# EasyEDA Pro project SoupPico.epro

# Schematic Schematic1
Board Name: Board1; Create Date: 2026-05-25; Page Name: P1; Project Name: Soup Pi; Schematic Name: Schematic1; Update Date: 2026-05-25; Company: EasyEDA.com; Page Size: A4; Version: V1.0
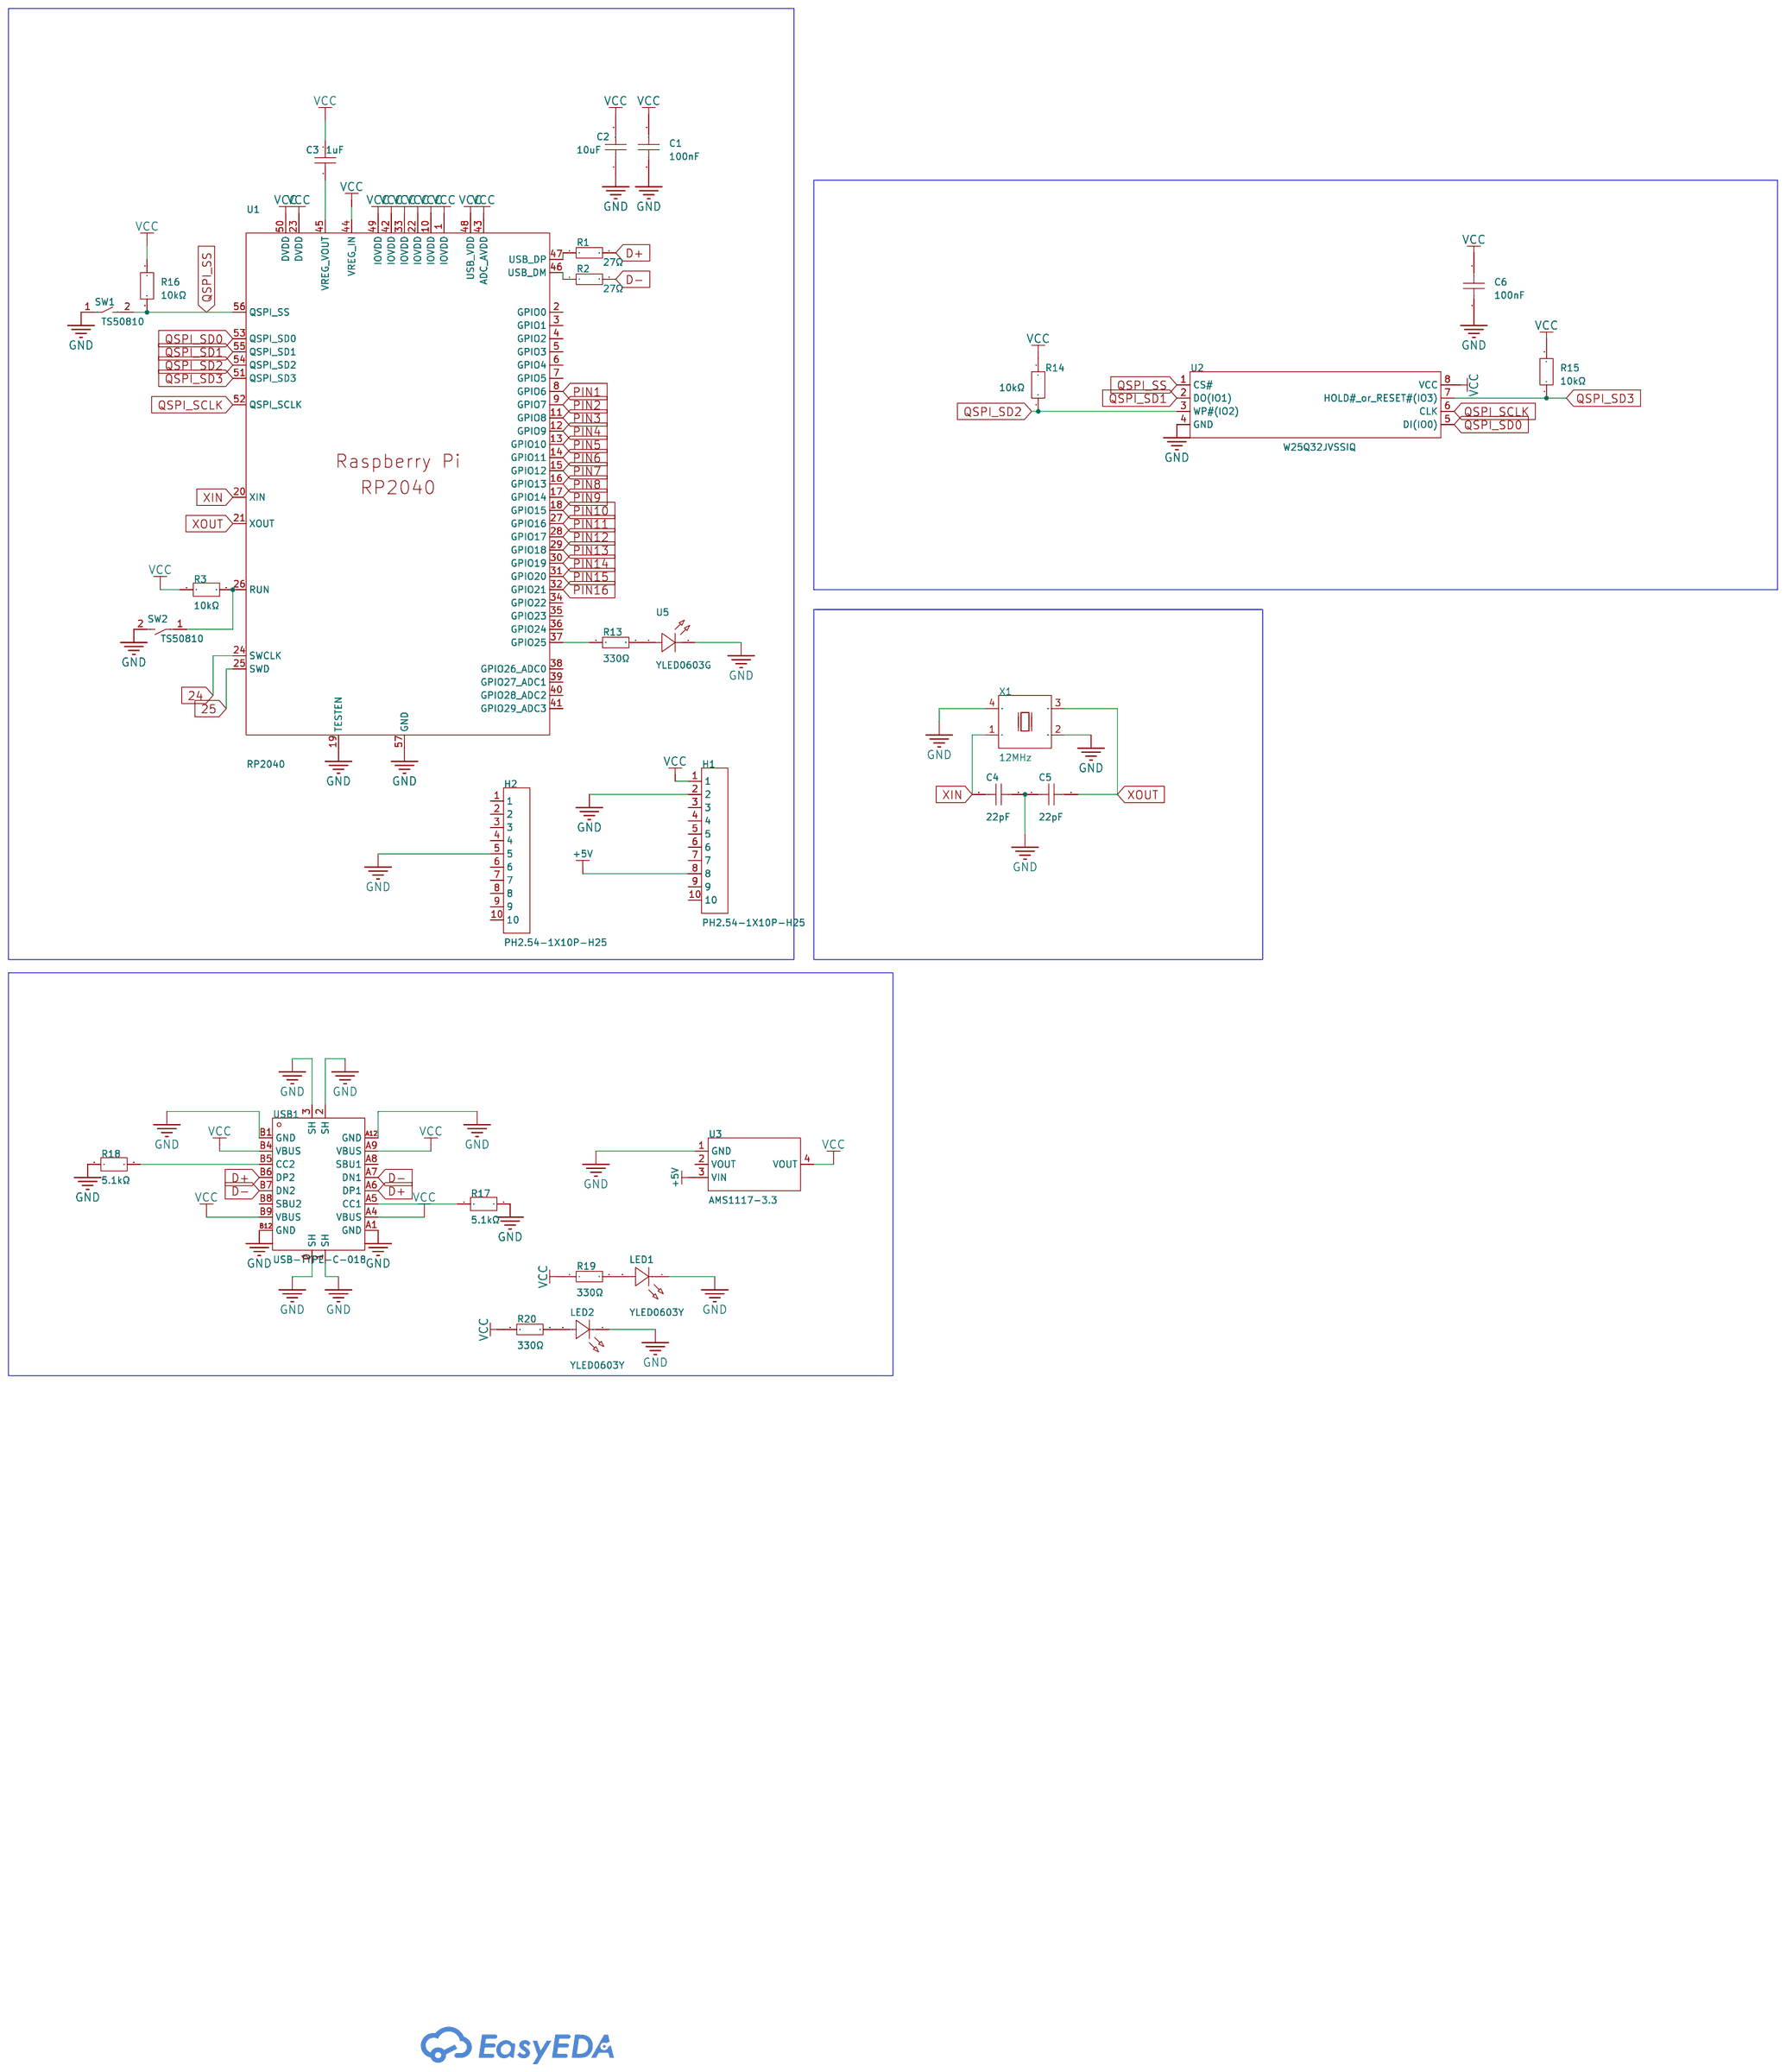
[diagram p0: schematic sheet]

## Parts
C1  100nF  [C0603]
C2  10uF  [C0603]
C3  1uF  [C0603]
C4  22pF  [C0805]
C5  22pF  [C0805]
C6  100nF  [C0603]
H1  PH2.54-1X10P-H25  [HDR-TH_10P-P2.54-V-M]
H2  PH2.54-1X10P-H25  [HDR-TH_10P-P2.54-V-M]
LED1  YLED0603Y  [LED0603-RD-1]
LED2  YLED0603Y  [LED0603-RD-1]
R1  27Ω  [R0603_NEW]
R2  27Ω  [R0603_NEW]
R3  10kΩ  [R0603_NEW]
R13  330Ω  [R0603_NEW]
R14  10kΩ  [R0603_NEW]
R15  10kΩ  [R0603_NEW]
R16  10kΩ  [R0603_NEW]
R17  5.1kΩ  [R0603_NEW]
R18  5.1kΩ  [R0603_NEW]
R19  330Ω  [R0603_NEW]
R20  330Ω  [R0603_NEW]
SW1  TS50810  [SW-SMD_L6.2-W3.7-LS8.0]
SW2  TS50810  [SW-SMD_L6.2-W3.7-LS8.0]
U1  RP2040  [QFN-56_L7.0-W7.0-P0.40-TL-EP4.0]
U2  W25Q32JVSSIQ  [SOIC-8_L5.3-W5.3-P1.27-LS8.0-BL]
U3  AMS1117-3.3  [SOT-223-3_L6.5-W3.4-P2.30-LS7.0-BR]
U5  YLED0603G  [LED0603-FD]
USB1  USB-TYPE-C-018  [USB-C_SMD-TYPE-C-31-M-12]
X1  12MHz  [OSC-SMD_4P-L5.0-W3.2-BL_SG5032]

## Library data of the parts
C1 C6 = CC0603KRX7R9BB104: Capacitance:100nF Tolerance:±10% Tolerance:±10% Voltage Rating:50V Temperature Coefficient:X7R; LCSC Part Name: 100nF ±10% 50V; Supplier Part: C14663; Manufacturer: YAGEO(国巨); Supplier Footprint: 0603; JLCPCB Part Class: Basic Part; Datasheet: https://item.szlcsc.com/datasheet/CC0603KRX7R9BB104/15331.html; Supplier: LCSC; Tolerance: ±10%; Voltage Rating: 50V; Temperature Coefficient: X7R
C2 = CL10A106KP8NNNC: Capacitance:10uF Tolerance:±10% Tolerance:±10% Voltage Rating:10V Temperature Coefficient:X5R; LCSC Part Name: 10uF ±10% 10V; Supplier Part: C19702; Manufacturer: SAMSUNG(三星); Supplier Footprint: 0603; JLCPCB Part Class: Basic Part; Datasheet: https://item.szlcsc.com/datasheet/CL10A106KP8NNNC/20411.html; Supplier: LCSC; Tolerance: ±10%; Voltage Rating: 10V; Temperature Coefficient: X5R
C3 = CL10B105KA8NNNC: Capacitance:1uF Tolerance:±10% Tolerance:±10% Voltage Rating:25V Temperature Coefficient:X7R; LCSC Part Name: 1uF ±10% 25V; Supplier Part: C29936; Manufacturer: SAMSUNG(三星); Supplier Footprint: 0603; JLCPCB Part Class: Extended Part; Datasheet: https://item.szlcsc.com/datasheet/CL10B105KA8NNNC/30690.html; Supplier: LCSC; Tolerance: ±10%; Voltage Rating: 25V; Temperature Coefficient: X7R
C4 C5 = TCC0805COG220J500BT: Capacitance:22pF Tolerance:±5% Tolerance:±5% Voltage Rating:50V Temperature Coefficient:C0G; LCSC Part Name: 22pF ±5% 50V; Supplier Part: C376875; Manufacturer: CCTC(三环); Supplier Footprint: 0805; JLCPCB Part Class: Extended Part; Datasheet: https://item.szlcsc.com/datasheet/TCC0805COG220J500BT/349234.html; Supplier: LCSC; Tolerance: ±5%; Voltage Rating: 50V; Temperature Coefficient: C0G
H1 H2 = PH2.54-1X10P-H25: Pin Structure:1x10P Pitch:2.54mm Row Spacing:- Circluar Pins/Square Pins:Pin Header Mounting Type:Through Hole Number of Rows:1 Number of Pins:10P Current Rating:3A Voltage Rating (Max):- Length of Mating Pin:6mm Insulation Height:2.5mm Length of End Conn; LCSC Part Name: 1x10P 间距:2.54mm 方针 直插; Supplier Part: C42431810; Manufacturer: JXTCONN(聚兴泰); Supplier Footprint: 插件,P=2.54mm; JLCPCB Part Class: Extended Part; Datasheet: https://item.szlcsc.com/datasheet/PH2.54-1X10P-H25/44458940.html; Supplier: LCSC; Pin Structure: 1x10P; Pitch: 2.54mm; Circluar Pins/Square Pins: Pin Header; Mounting Type: Through Hole; Number of Rows: 1; Number of Pins: 10P; Current Rating: 3A; Length of Mating Pin: 6mm; Insulation Height: 2.5mm; Length of End Connection Pin: 3mm; Contact Material: Brass; Contact Plating: Gold; Operating Temperature: -40℃~+105℃; Color: Black
LED1 LED2 = YLED0603Y: Lamp Holder Type:- Illumination Color:Yellow Voltage - Forward(Vf):1.8V~2.4V Voltage - Forward(Vf):1.8V~2.4V Power(Watts):- Forward Current:30mA Wavelength - Dominant:585nm~595nm Wavelength - Dominant:585nm~595nm Peak Wavelength:- Diode Configuration:Disc; LCSC Part Name: 黄色 独立二极管; Supplier Part: C19273152; Manufacturer: YONGYUTAI(永裕泰); Supplier Footprint: 0603; JLCPCB Part Class: Extended Part; Datasheet: https://item.szlcsc.com/datasheet/YLED0603Y/20555406.html; Supplier: LCSC; Illumination Color: Yellow; Voltage - Forward(Vf): 1.8V~2.4V; Forward Current: 30mA; Wavelength - Dominant: 585nm~595nm; Diode Configuration: Discrete Diode; Luminous Intensity: 144mcd; Viewing Angle: 120°; Operating Temperature: -40℃~+85℃
R1 R2 = RC0603FR-0727RL: Type:Thick Film Resistors Resistance: Tolerance:±1% Tolerance:±1% Power(Watts): Overload Voltage (Max): Temperature Coefficient:±100ppm/℃ Temperature Coefficient:±100ppm/℃ Operating Temperature Range:-55℃~+155℃ Operating Temperature Range:-55℃~+155℃; LCSC Part Name: 厚膜电阻 27Ω ±1% 100mW; Supplier Part: C137753; Manufacturer: YAGEO(国巨); Supplier Footprint: 0603; JLCPCB Part Class: Extended Part; Datasheet: https://atta.szlcsc.com/upload/public/pdf/source/20180821/C275644_0D56F95EFF785E7D9A1FEF436B37DA78.pdf; Supplier: LCSC; Type: Thick Film Resistors; Tolerance: ±1%; Temperature Coefficient: ±100ppm/℃; Operating Temperature Range: -55℃~+155℃
R3 R14-R16 = FRC0603J103 TS: Type:Thick Film Resistor Resistance:10kΩ Tolerance:±5% Tolerance:±5% Power(Watts):100mW Voltage-Supply(Max):75V Temperature Coefficient:±100ppm/℃ Temperature Coefficient:±100ppm/℃ Operating Temperature:-55℃~+155℃ Operating Temperature:-55℃~+155℃; LCSC Part Name: 10kΩ ±5% 100mW 厚膜电阻; Supplier Part: C2930027; Manufacturer: FOJAN(富捷); Supplier Footprint: 0603; JLCPCB Part Class: Extended Part; Datasheet: https://item.szlcsc.com/datasheet/FRC0603J103%2520TS/3266960.html; Supplier: LCSC; Type: Thick Film Resistor; Tolerance: ±5%; Power(Watts): 100mW; Voltage-Supply(Max): 75V; Temperature Coefficient: ±100ppm/℃; Operating Temperature: -55℃~+155℃
R13 R19 R20 = RC0603FR-07330RL: Type:Thick Film Resistors Resistance: Tolerance:±1% Tolerance:±1% Power(Watts): Overload Voltage (Max): Temperature Coefficient:±100ppm/℃ Temperature Coefficient:±100ppm/℃ Operating Temperature Range:-55℃~+155℃ Operating Temperature Range:-55℃~+155℃; LCSC Part Name: 厚膜电阻 330Ω ±1% 100mW; Supplier Part: C105881; Manufacturer: YAGEO(国巨); Supplier Footprint: 0603; JLCPCB Part Class: Extended Part; Datasheet: https://atta.szlcsc.com/upload/public/pdf/source/20180821/C275644_0D56F95EFF785E7D9A1FEF436B37DA78.pdf; Supplier: LCSC; Type: Thick Film Resistors; Tolerance: ±1%; Temperature Coefficient: ±100ppm/℃; Operating Temperature Range: -55℃~+155℃
R17 R18 = FRC0603F5101TS: Type:Thick Film Resistor Resistance:5.1kΩ Tolerance:±1% Tolerance:±1% Power(Watts):100mW Voltage-Supply(Max):75V Temperature Coefficient:±100ppm/℃ Temperature Coefficient:±100ppm/℃ Operating Temperature:-55℃~+155℃ Operating Temperature:-55℃~+155℃; LCSC Part Name: 5.1kΩ ±1% 100mW 厚膜电阻; Supplier Part: C2907044; Manufacturer: FOJAN(富捷); Supplier Footprint: 0603; JLCPCB Part Class: Extended Part; Supplier: LCSC; Type: Thick Film Resistor; Tolerance: ±1%; Power(Watts): 100mW; Voltage-Supply(Max): 75V; Temperature Coefficient: ±100ppm/℃; Operating Temperature: -55℃~+155℃
SW1 SW2 = TS50810-411-02528: Circuit:SPST Actuator Style:Rectangular Button Mounting Type:Surface Mount,Vertical Length:6.1mm Width:3.7mm Switch Height:2.5mm with Bracket:Without Bracket Contact Current:50mA Voltage Rating:12V Actuator/Cap Color:Gray With Lamp:- Termination Style:Gul; LCSC Part Name: 6.1*3.6*2.5 立贴   轻触开关; Supplier Part: C42400876; Manufacturer: HMTCONN(华明通); Supplier Footprint: SMD,6.2x3.7mm; JLCPCB Part Class: Extended Part; Datasheet: https://item.szlcsc.com/datasheet/TS50810-411-02528/44355800.html; Supplier: LCSC; Circuit: SPST; Actuator Style: Rectangular Button; Mounting Type: Surface Mount,Vertical; Length: 6.1mm; Width: 3.7mm; Switch Height: 2.5mm; with Bracket: Without Bracket; Contact Current: 50mA; Voltage Rating: 12V; Actuator/Cap Color: Gray; Termination Style: Gull Wing
U1 = RP2040: Supplier Part: C2961140; Manufacturer: Raspberry Pi(树莓派); Supplier Footprint: QFN-56-EP(7x7); JLCPCB Part Class: Extended Part; Datasheet: https://atta.szlcsc.com/upload/public/pdf/source/20220208/8D54DD1C91A7987165C42A5C4D6BB336.pdf; Supplier: LCSC
U2 = W25Q32JVSSIQ: Interface:SPI Memory Size:32Mbit Clock Frequency:133MHz Voltage - Supply:2.7V~3.6V Voltage - Supply:2.7V~3.6V Standby Supply Current:1uA Program / Erase Cycles:100,000 cycles Page Programming Time (Tpp):3ms Block Erase Time(tBE):- Data Retention - TDR (Ye; LCSC Part Name: 支持双线、四线SPI接口的3V、32Mbit 串行SPI闪存; Supplier Part: C179173; Manufacturer: Winbond(华邦); Supplier Footprint: SOIC-8-208mil; JLCPCB Part Class: Extended Part; Datasheet: https://item.szlcsc.com/datasheet/W25Q32JVSSIQ/190567.html; Supplier: LCSC; Interface: SPI; Memory Size: 32Mbit; Clock Frequency: 133MHz; Voltage - Supply: 2.7V~3.6V; Standby Supply Current: 1uA; Program / Erase Cycles: 100,000 cycles; Page Programming Time (Tpp): 3ms; Data Retention - TDR (Year): 20 Years; Operating Temperature: -40℃~+85℃
U3 = AMS1117-3.3_C6186: Output Type:Fixed Voltage - Supply:15V Output Voltage:3.3V Output Voltage:3.3V Output Current:1A Power Supply Rejection Ratio (PSRR):72dB@(120Hz) Voltage Dropout:1.1V@(800mA) standby current:5mA Noise:0.003%Vout Features:Over Current Protection；Thermal Sh; LCSC Part Name: 3.3V 1A 15V; Supplier Part: C6186; Manufacturer: AMS; Supplier Footprint: SOT-223; JLCPCB Part Class: Basic Part; Datasheet: https://item.szlcsc.com/datasheet/AMS1117-3.3/6652.html; Supplier: LCSC; Output Type: Fixed; Voltage - Supply: 15V; Output Voltage: 3.3V; Output Current: 1A; Power Supply Rejection Ratio (PSRR): 72dB@(120Hz); Voltage Dropout: 1.1V@(800mA); standby current: 5mA; Noise: 0.003%Vout; Features: Over Current Protection；Thermal Shutdown; Operating Temperature: -40℃~+125℃; Output Configuration: Positive; Number of Outputs: 1
U5 = YLED0603G: Lamp Holder Type:- Illumination Color:Emerald Green Voltage - Forward(Vf):2.6V~3.2V Voltage - Forward(Vf):2.6V~3.2V Power(Watts):- Forward Current:25mA Wavelength - Dominant:510nm~531nm Wavelength - Dominant:510nm~531nm Peak Wavelength:- Peak Wavelength:-; LCSC Part Name: 翠绿色 独立二极管; Supplier Part: C19273151; Manufacturer: YONGYUTAI(永裕泰); Supplier Footprint: 0603; JLCPCB Part Class: Extended Part; Datasheet: https://item.szlcsc.com/datasheet/YLED0603G/20555405.html; Supplier: LCSC; Illumination Color: Emerald Green; Voltage - Forward(Vf): 2.6V~3.2V; Forward Current: 25mA; Wavelength - Dominant: 510nm~531nm; Diode Configuration: Discrete Diode; Luminous Intensity: 358mcd; Viewing Angle: 120°; Operating Temperature: -40℃~+85℃
USB1 = USB-TYPE-C-018: Connector Type:Type-C Protocol Standard:- Gender:Female Mounting Type:Surface Mount, Right Angle Number of Contacts:16P Number of Ports:1 Current Rating-Power:3A Voltage Rating:5V Connect-Disconnect Life:10,000 cycles Length:7.35mm Operating Temperature:-; LCSC Part Name: Type-C 母 卧贴; Supplier Part: C2927038; Manufacturer: DEALON(德艺隆); Supplier Footprint: SMD; JLCPCB Part Class: Extended Part; Datasheet: https://item.szlcsc.com/datasheet/USB-TYPE-C-018/3252507.html; Supplier: LCSC; Connector Type: Type-C; Gender: Female; Mounting Type: Surface Mount, Right Angle; Number of Contacts: 16P; Number of Ports: 1; Current Rating-Power: 3A; Voltage Rating: 5V; Connect-Disconnect Life: 10,000 cycles; Length: 7.35mm; Operating Temperature: -25℃~+85℃
X1 = OVETGLJANF-12MHZ: Frequency:12MHz Voltage - Supply:3.3V Voltage - Supply:3.3V Current - Supply:10mA Frequency Stability:±50ppm Frequency Stability:±50ppm Operating Temperature:-40℃~+85℃ Operating Temperature:-40℃~+85℃; LCSC Part Name: 12MHz 3.3V; Supplier Part: C295511; Manufacturer: TAITIEN(泰艺电子); Supplier Footprint: SMD5032-4P; JLCPCB Part Class: Extended Part; Datasheet: https://item.szlcsc.com/datasheet/OVETGLJANF-12MHZ/279940.html; Supplier: LCSC; Voltage - Supply: 3.3V; Current - Supply: 10mA; Frequency Stability: ±50ppm; Operating Temperature: -40℃~+85℃

## Nets
+5V: H1.8 U3.3(VIN)
GND: C1.2 C2.1 C4.1 C5.1 C6.2 H1.2 H2.5 LED1.1(C) LED2.1(C) R17.2 R18.1 SW1.1 SW2.2 U1.19(TESTEN) U1.57(GND) U2.4(GND) U3.1(GND) U5.2(-) USB1.0(SH) USB1.1(SH) USB1.2(SH) USB1.3(SH) USB1.A1(GND) USB1.A12(GND) USB1.B1(GND) USB1.B12(GND) X1.2(GND) X1.4(VCC)
VCC: C1.1 C2.2 C3.2 C6.1 H1.1 R3.1 R14.1 R15.2 R16.1 R19.1 R20.1 U1.1(IOVDD) U1.10(IOVDD) U1.22(IOVDD) U1.23(DVDD) U1.33(IOVDD) U1.42(IOVDD) U1.43(ADC_AVDD) U1.44(VREG_IN) U1.48(USB_VDD) U1.49(IOVDD) U1.50(DVDD) U2.8(VCC) U3.4(VOUT) USB1.A4(VBUS) USB1.A9(VBUS) USB1.B4(VBUS) USB1.B9(VBUS)
24: U1.24(SWCLK)
25: U1.25(SWD)
D+: R1.2 USB1.A6(DP1) USB1.B6(DP2)
D-: R2.2 USB1.A7(DN1) USB1.B7(DN2)
PIN1: U1.8(GPIO6)
PIN2: U1.9(GPIO7)
PIN3: U1.11(GPIO8)
PIN4: U1.12(GPIO9)
PIN5: U1.13(GPIO10)
PIN6: U1.14(GPIO11)
PIN7: U1.15(GPIO12)
PIN8: U1.16(GPIO13)
PIN9: U1.17(GPIO14)
PIN10: U1.18(GPIO15)
PIN11: U1.27(GPIO16)
PIN12: U1.28(GPIO17)
PIN13: U1.29(GPIO18)
PIN14: U1.30(GPIO19)
PIN15: U1.31(GPIO20)
PIN16: U1.32(GPIO21)
QSPI_SCLK: U1.52(QSPI_SCLK) U2.6(CLK)
QSPI_SD0: U1.53(QSPI_SD0) U2.5(DI(IO0))
QSPI_SD1: U1.55(QSPI_SD1) U2.2(DO(IO1))
QSPI_SD2: R14.2 U1.54(QSPI_SD2) U2.3(WP#(IO2))
QSPI_SD3: R15.1 U1.51(QSPI_SD3) U2.7(HOLD# or RESET#(IO3))
QSPI_SS: R16.2 SW1.2 U1.56(QSPI_SS) U2.1(CS#)
XIN: C4.2 U1.20(XIN) X1.1(tri)
XOUT: C5.2 U1.21(XOUT) X1.3(OUT)
$1N1276: R1.1 U1.47(USB_DP)
$1N1315: R2.1 U1.46(USB_DM)
$1N2745: R3.2 SW2.1 U1.26(RUN)
$1N2987: R13.1 U1.37(GPIO25)
$1N3026: R13.2 U5.1(+)
$1N3299: C3.1 U1.45(VREG_VOUT)
$1N4320: R17.1 USB1.A5(CC1)
$1N4359: R18.2 USB1.B5(CC2)
$1N4643: LED1.2(A) R19.2
$1N5849: LED2.2(A) R20.2

Not connected (* = marked no-connect by the designer): H1 3 4 5 6 7 9 10; H2 1 2 3 4 6 7 8 9 10; U1 2(GPIO0) 3(GPIO1) 4(GPIO2) 5(GPIO3) 6(GPIO4) 7(GPIO5) 34(GPIO22) 35(GPIO23) 36(GPIO24) 38(GPIO26_ADC0) 39(GPIO27_ADC1) 40(GPIO28_ADC2) 41(GPIO29_ADC3); U3 2(VOUT); USB1 A8(SBU1) B8(SBU2)

# Board PCB1
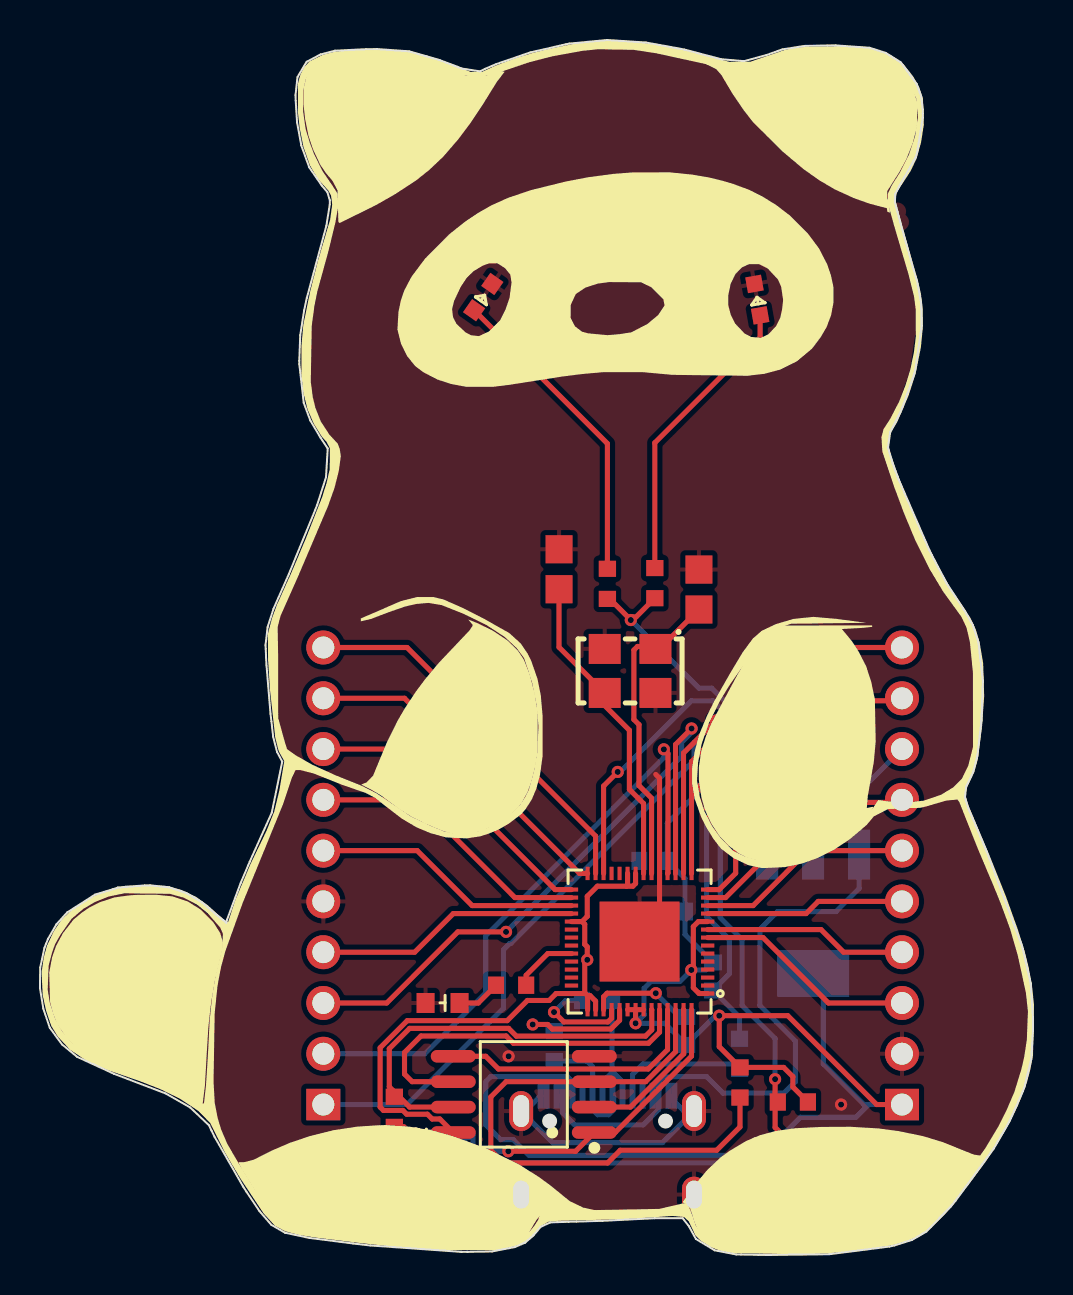
[diagram p1: board, top side]
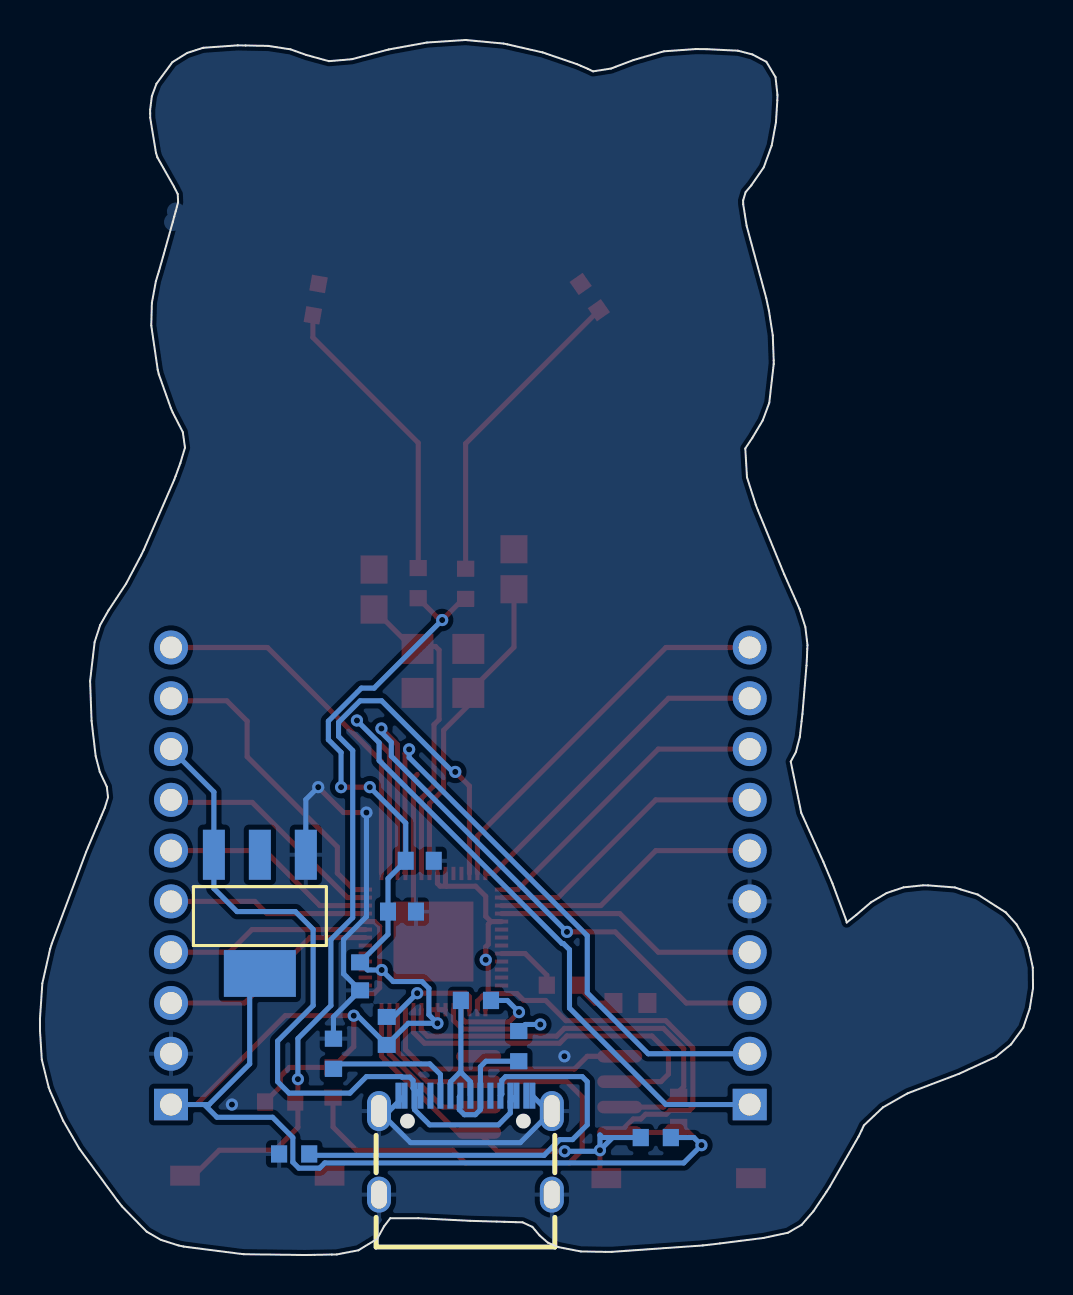
[diagram p2: board, bottom side, seen from below]

Outline 49.69 x 60.77 mm; copper layers: Top Layer, Bottom Layer. Coordinates in mm from the lower left corner of the outline.
Outline path: 0,13.35 0.01,14.38 0.23,15.37 0.31,15.58 0.4,15.8 0.82,16.54 1.37,17.14 2.76,18.03 3.64,18.29 3.9,18.38 5.25,18.49 5.51,18.49 6.48,18.39 7.33,18.1 8.11,17.64 8.84,17.01 9.32,16.63 9.36,16.78 10.04,18.59 10.42,19.49 10.49,19.67 11.6,22.12 12.12,24.68 11.86,25.16 11.67,25.91 11.58,26.69 11.54,27.06 11.34,29.49 11.31,29.89 11.3,30.32 11.28,30.5 11.39,31.41 11.68,32.32 12.45,34.04 13.77,37.26 13.87,37.52 14.31,38.9 14.4,40.34 14.05,40.87 13.53,41.74 13.2,42.62 12.98,44.56 12.98,44.74 13.02,46 13.22,47.24 13.35,47.86 14.33,51.48 14.5,52.55 14.51,52.75 14.38,53.16 14.1,53.5 13.47,54.4 13.08,55.49 12.86,56.65 12.8,57.74 12.79,58.02 12.89,58.92 13.34,59.68 14.04,60.05 14.76,60.24 16.31,60.31 16.88,60.32 18.47,60.21 20,59.77 20.88,59.43 21.11,59.34 22.02,59.2 22.27,59.33 22.63,59.48 22.83,59.57 24.53,60.15 26.3,60.55 26.49,60.59 28.38,60.77 30.32,60.65 32.24,60.3 34.07,59.81 35.23,59.71 36.36,60.02 36.91,60.22 37.15,60.3 38.26,60.48 39.4,60.5 39.8,60.5 41.52,60.38 42.32,60.12 43.06,59.66 43.86,58.58 44.09,57.97 44.18,57.29 44.18,57.09 44.17,56.88 43.89,55.13 43.81,54.9 42.98,53.44 42.8,53.07 42.78,52.66 42.84,52.44 42.9,52.2 42.97,51.94 43.04,51.67 43.48,50.1 43.74,49.2 43.89,48.71 44.09,47.62 44.12,46.49 43.8,44.28 43.74,44.06 43.15,42.37 43.05,42.14 42.54,41.16 42.43,40.38 42.67,39.6 42.91,38.95 42.97,38.78 44.5,35.27 44.63,35 45.38,33.58 46.26,32.24 46.68,31.51 46.96,30.65 47.18,28.71 47.11,26.72 46.9,24.96 46.7,24.17 46.34,23.42 46.28,22.89 46.45,22.36 46.59,22.02 46.67,21.83 46.84,21.43 47.29,20.37 47.38,20.15 49.1,15.58 49.18,15.31 49.57,13.59 49.69,11.82 49.69,11.21 49.6,9.78 49.26,8.39 49.19,8.2 48.53,6.71 47.72,5.32 45.81,2.72 45.58,2.43 44.35,1.17 43.64,0.76 42.76,0.48 42.51,0.42 39.49,0.04 36.45,0 35.94,0.01 35.08,0.02 34.84,0.03 33.76,0.24 32.82,0.8 32.47,1.44 32.16,1.84 30.76,1.84 28.15,1.71 26.84,1.67 26.45,1.66 25.88,1.64 25.54,1.63 25.05,1.41 24.7,0.99 24.28,0.62 23.75,0.4 22.62,0.18 21.38,0.16 21.07,0.16 16.52,0.48 15.67,0.58 13.48,0.85 12.26,1.11 11.58,1.51 10.99,2.19 10.34,3.15 10.17,3.42 8.73,5.92 8.58,6.22 8.47,6.48 7.51,7.38 6.28,8.09 3.7,9.06 1.87,9.91 1.1,10.54 0.49,11.37 0.17,12.32 0,13.35
Stack: Top Layer 0.035mm / Dielectric1 1.51mm FR4 er 4.5 / Bottom Layer 0.035mm

## Design rules (mm)
template: JLCPCB Capability(Two Layers Board)
spacing copperThickness1oz (default): track to track 0.102, other pairs 0.152 to 0.3
spacing copperThickness2oz: track to track 0.203, other pairs 0.152 to 0.3
track width copperThickness1oz (default): min 0.127, default 0.254, max 2.54
track width copperThickness2oz: min 0.203, default 0.254, max 2.54
differential pair differentialPair (default): width min 0.127, default 0.254, max 2.54; gap min 0.152, default 0.152
via viaSize (default): diameter min 0.5, default 0.61, max 10; hole min 0.3, default 0.305, max 6.3

## Placement (name value [footprint] x y rotation side)
C1  100nF  [C0603]  30.69 19.72 180 bottom
C2  10uF  [C0603]  31.58 17.18 0 bottom
C3  1uF  [C0603]  32.34 11.21 270 bottom
C4  22pF  [C0805]  32.97 33.29 270 top
C5  22pF  [C0805]  25.97 34.3 270 top
C6  100nF  [C0603]  33.67 13.94 270 bottom
H1  PH2.54-1X10P-H25  [HDR-TH_10P-P2.54-V-M]  43.13 18.96 90 top
H2  PH2.54-1X10P-H25  [HDR-TH_10P-P2.54-V-M]  14.18 18.96 90 top
LED1  YLED0603Y  [LED0603-RD-1]  22.18 47.91 235 top
LED2  YLED0603Y  [LED0603-RD-1]  35.89 47.78 280 top
R1  27Ω  [R0603_NEW]  25.73 10.45 270 bottom
R2  27Ω  [R0603_NEW]  27.88 12.73 0 bottom
R3  10kΩ  [R0603_NEW]  37.67 7.65 180 top
R13  330Ω  [R0603_NEW]  23.57 13.49 180 top
R14  10kΩ  [R0603_NEW]  35.03 8.63 270 top
R15  10kΩ  [R0603_NEW]  17.73 7.16 270 top
R16  10kΩ  [R0603_NEW]  18.88 5.88 0 bottom
R17  5.1kΩ  [R0603_NEW]  35 10.07 90 bottom
R18  5.1kΩ  [R0603_NEW]  36.97 5.05 180 bottom
R19  330Ω  [R0603_NEW]  28.39 33.57 90 top
R20  330Ω  [R0603_NEW]  30.76 33.61 90 top
SW1  TS50810  [SW-SMD_L6.2-W3.7-LS8.0]  17.73 3.84 0 top
SW2  TS50810  [SW-SMD_L6.2-W3.7-LS8.0]  38.81 3.97 180 top
U1  RP2040  [QFN-56_L7.0-W7.0-P0.40-TL-EP4.0]  30 15.68 180 top
U2  W25Q32JVSSIQ  [SOIC-8_L5.3-W5.3-P1.27-LS8.0-BL]  24.21 8.03 90 top
U3  AMS1117-3.3  [SOT-223-3_L6.5-W3.4-P2.30-LS7.0-BR]  38.69 17.05 90 bottom
U5  YLED0603G  [LED0603-FD]  20.15 12.61 180 top
USB1  USB-TYPE-C-018  [USB-C_SMD-TYPE-C-31-M-12]  28.4 5.49 180 bottom
X1  12MHz  [OSC-SMD_4P-L5.0-W3.2-BL_SG5032]  29.53 29.21 180 top

## Footprints (pads in the part's own frame, mm; a bottom-side part is the same pattern mirrored in y, then rotated)
C0603
  rect 0.8x0.9 smd: 1(-0.7,0) 2(0.7,0)
C0805
  rect 1.41x1.35 smd: 1(-1,0) 2(1,0)
HDR-TH_10P-P2.54-V-M
  rect 1.575x1.7 hole 1.1: 1(-11.43,0)
  round 1.7 hole 1.1: 2(-8.89,0) 3(-6.35,0) 4(-3.81,0) 5(-1.27,0) 6(1.27,0) 7(3.81,0) 8(6.35,0) 9(8.89,0) 10(11.43,0)
LED0603-FD
  rect 0.9x1 smd: 1(-0.85,0) 2(0.85,0)
LED0603-RD-1
  rect 0.8x0.8 smd: 1(-0.799,-0.004) 2(0.799,0.004)
OSC-SMD_4P-L5.0-W3.2-BL_SG5032
  rect 1.6x1.5 smd: 1(-1.27,-1.1) 2(1.27,-1.1) 3(1.27,1.1) 4(-1.27,1.1)
QFN-56_L7.0-W7.0-P0.40-TL-EP4.0
  rect 0.665x0.2 smd: 1(-3.408,2.6) 2(-3.408,2.2) 3(-3.408,1.8) 4(-3.408,1.4) 5(-3.408,1) 6(-3.408,0.6) 7(-3.408,0.2) 8(-3.408,-0.2) 9(-3.408,-0.6) 10(-3.408,-1) 11(-3.408,-1.4) 12(-3.408,-1.8) 13(-3.408,-2.2) 14(-3.408,-2.6) 29(3.408,-2.6) 30(3.408,-2.2) 31(3.408,-1.8) 32(3.408,-1.4) 33(3.408,-1) 34(3.408,-0.6) 35(3.408,-0.2) 36(3.408,0.2) 37(3.408,0.6) 38(3.408,1) 39(3.408,1.4) 40(3.408,1.8) 41(3.408,2.2) 42(3.408,2.6)
  rect 0.2x0.665 smd: 15(-2.6,-3.408) 16(-2.2,-3.408) 17(-1.8,-3.408) 18(-1.4,-3.408) 19(-1,-3.408) 20(-0.6,-3.408) 21(-0.2,-3.408) 22(0.2,-3.408) 23(0.6,-3.408) 24(1,-3.408) 25(1.4,-3.408) 26(1.8,-3.408) 27(2.2,-3.408) 28(2.6,-3.408) 43(2.6,3.408) 44(2.2,3.408) 45(1.8,3.408) 46(1.4,3.408) 47(1,3.408) 48(0.6,3.408) 49(0.2,3.408) 50(-0.2,3.408) 51(-0.6,3.408) 52(-1,3.408) 53(-1.4,3.408) 54(-1.8,3.408) 55(-2.2,3.408) 56(-2.6,3.408)
  rect 4x4 smd: 57(0,0)
R0603_NEW
  rect 0.806x0.864 smd: 1(-0.753,0) 2(0.753,0)
SOIC-8_L5.3-W5.3-P1.27-LS8.0-BL
  oval 0.63x2.25 smd: 1(-1.905,-3.53) 2(-0.635,-3.53) 3(0.635,-3.53) 4(1.905,-3.53) 5(1.905,3.53) 6(0.635,3.53) 7(-0.635,3.53) 8(-1.905,3.53)
SOT-223-3_L6.5-W3.4-P2.30-LS7.0-BR
  rect 2.5x1.1 smd: 1(2.97,-2.3) 2(2.97,0) 3(2.97,2.3)
  rect 2.34x3.6 smd: 4(-2.97,0)
SW-SMD_L6.2-W3.7-LS8.0
  rect 1.485x1 smd: 1(-3.618,0) 2(3.618,0)
USB-C_SMD-TYPE-C-31-M-12
  oval 1.2x2 hole 0.8x1.6: 0(-4.325,1.706) 1(4.325,1.706)
  oval 1.2x1.8 hole 0.8x1.4: 2(4.325,-2.474) 3(-4.325,-2.474)
  rect 0.3x1.3 smd: A1(-3.35,2.474) A4(-2.55,2.474) A5(-1.25,2.474) A6(-0.25,2.474) A7(0.25,2.474) A8(1.25,2.474) A9(2.55,2.474) A12(3.35,2.474) B1(3.05,2.474) B4(2.25,2.474) B5(1.75,2.474) B6(0.75,2.474) B7(-0.75,2.474) B8(-1.75,2.474) B9(-2.25,2.474) B12(-3.05,2.474)

## Nets
+5V: H1.8 U3.3 USB1.A4 USB1.A9 USB1.B4 USB1.B9
GND: C1.2 C2.1 C4.1 C5.1 C6.2 H1.2 H2.5 LED1.1 LED2.1 R17.2 R18.1 SW1.1 SW2.2 U1.19 U1.57 U2.4 U3.1 U5.2 USB1.0 USB1.1 USB1.2 USB1.3 USB1.A1 USB1.A12 USB1.B1 USB1.B12 X1.2 X1.4
VCC: C1.1 C2.2 C3.2 C6.1 H1.1 R3.1 R14.1 R15.2 R16.1 R19.1 R20.1 U1.1 U1.10 U1.22 U1.23 U1.33 U1.42 U1.43 U1.44 U1.48 U1.49 U1.50 U2.8 U3.4
24: U1.24
25: U1.25
D+: R1.2 USB1.A6 USB1.B6
D-: R2.2 USB1.A7 USB1.B7
PIN1: H1.3 U1.8
PIN2: H1.4 U1.9
PIN3: H1.5 U1.11
PIN4: H1.6 U1.12
PIN5: H1.7 U1.13
PIN6: H1.9 U1.14
PIN7: H1.10 U1.15
PIN8: H2.1 U1.16
PIN9: H2.3 U1.17
PIN10: H2.2 U1.18
PIN11: H2.10 U1.27
PIN12: H2.9 U1.28
PIN13: H2.8 U1.29
PIN14: H2.7 U1.30
PIN15: H2.6 U1.31
PIN16: H2.4 U1.32
QSPI_SCLK: U1.52 U2.6
QSPI_SD0: U1.53 U2.5
QSPI_SD1: U1.55 U2.2
QSPI_SD2: R14.2 U1.54 U2.3
QSPI_SD3: R15.1 U1.51 U2.7
QSPI_SS: R16.2 SW1.2 U1.56 U2.1
XIN: C4.2 U1.20 X1.1
XOUT: C5.2 U1.21 X1.3
$1N1276: R1.1 U1.47
$1N1315: R2.1 U1.46
$1N2745: R3.2 SW2.1 U1.26
$1N2987: R13.1 U1.37
$1N3026: R13.2 U5.1
$1N3299: C3.1 U1.45
$1N4320: R17.1 USB1.A5
$1N4359: R18.2 USB1.B5
$1N4643: LED1.2 R19.2
$1N5849: LED2.2 R20.2

Pads without a net: U1 2 3 4 5 6 7 34 35 36 38 39 40 41; U3 2; USB1 A8 B8

## Via types
v1: diameter 0.61, hole 0.305, Top Layer to Bottom Layer, 23 vias

## Routing (per net, layer and track width the routed paths; a pad name or vN(x,y) marks a point on that pad's centre or on a via; arc(x,y) is an arc through that point)
+5V: length 37.4
  Bottom Layer w0.254: USB1.A4 30.95,7.27 30.19,6.51 26.75,6.51 26.16,7.1 26.16,7.66 USB1.A9 ; USB1.B9 31.02,8.34 31.02,8.73 31.19,8.9 31.58,8.9 31.61,8.92 33.35,8.92 34.18,8.1 37.23,8.1 37.8,8.67 37.8,10.7 36.02,12.48 36.02,16.29 36.91,17.18 39.83,17.18 40.99,18.33 U3.3 40.99,23.16 H1.8
GND: length 39.5
  Top Layer w0.254: v1(35.77,23.4) 34.5,22.13 v1(33.35,22.13) ; 31,16.68 U1.19 31,23.85 30.81,24.04
  Bottom Layer w0.254: USB1.A12 24.28,7.2 24.08,7.2 25.65,5.62 31.15,5.62 USB1.0 32.22,7.2 USB1.B12 ; v1(33.35,22.13) 33.35,16.92 34.5,15.78 34.5,14.06 C6.2 35,11.91 R17.2 ; U3.1 36.39,22.78 v1(35.77,23.4)
  vias: v1(23.45,9.94) v1(40.09,7.53)
VCC: length 135.1
  Top Layer w0.254: R3.1 37.67,8.41 37.67,8.92 37.21,9.38 R14.1 33.99,10.42 v1(33.99,11.97) 37.42,11.97 41.86,7.53 H1.1 ; U1.49 v1(29.8,11.59) ; U1.49 U1.48 ; U1.49 U1.50 ; U1.22 29.8,18.58 29.67,18.45 29.35,18.45 ; v1(27.38,14.76) 27.38,15.41 27.26,15.54 27.26,16.54 27.12,16.68 ; R20.1 29.82,31.91 29.42,31.91 28.51,32.82 R19.1 ; U1.43 27.4,12.97 ; 27.4,12.97 27.26,13.11 ; 27.4,12.97 27.53,12.97 27.8,12.7 U1.44 ; 27.12,16.68 27.38,16.94 27.38,17.94 27.89,18.45 29.35,18.45 ; 27.12,16.68 U1.33 ; 27.26,14.76 27.26,13.11 ; 27.26,13.11 27.22,13.08 U1.42 25.82,13.08 25.48,12.73 24.39,12.73 23.38,11.72 18.38,11.72 17.02,10.37 17.02,7.4 17.19,7.23 18.16,7.23 18.35,7.04 19.39,7.04 19.62,6.8 20,6.8 U2.8 18.5,6.13 18.22,6.41 R15.2 17.5,6.41 v1(16.59,5.49) ; 29.35,18.45 29.4,18.5 U1.23 ; v1(34.62,23.4) v1(33.19,23.4) ; U1.10 32.95,16.68 32.69,16.42 32.69,13.37 32.96,13.1 32.99,13.1 33.01,13.08 U1.1
  Bottom Layer w0.254: v1(29.56,31.76) 32.97,28.35 33.61,28.35 35.26,26.7 35.26,25.77 34.62,25.14 v1(34.62,23.4) ; U3.4 39.2,13.57 39.2,9.56 41.23,7.53 41.47,7.53 ; 41.47,7.53 H1.1 ; 41.47,7.53 40.83,6.89 38.05,6.89 37.04,5.88 37.04,4.64 36.74,4.34 35.7,4.34 35.44,4.6 17.48,4.6 v1(16.59,5.49) 16.97,5.88 R16.1 ; v1(33.19,23.4) 31.39,21.6 C1.1 32.28,18.83 C2.2 32.28,16.03 C6.1 33.29,14.26 v1(32.59,14.26) 32.59,14.25 32.02,13.68 30.57,13.68 30.23,13.34 30.23,12.02 v1(29.8,11.59) 31.26,11.59 C3.2 33.8,11.97 v1(33.99,11.97)
D+: length 6.2
  Bottom Layer w0.254: R1.2 27.38,9.69 27.65,9.42 USB1.B6 27.65,7.27 27.91,7.02 28.45,7.02 28.71,7.27 28.71,7.91 USB1.A6
D-: length 6.4
  Bottom Layer w0.254: 28.61,9.12 28.63,9.14 R2.2 ; 28.61,9.12 28.15,8.66 USB1.A7 ; 28.61,9.12 28.69,9.12 29.15,8.66 USB1.B7
PIN1: length 11.1
  Top Layer w0.254: H1.3 39.45,12.61 36.18,15.88 U1.8
PIN2: length 10.2
  Top Layer w0.254: H1.4 40.21,15.15 39.08,16.28 U1.9
PIN3: length 10
  Top Layer w0.254: H1.5 38.94,17.69 38.33,17.08 U1.11
PIN4: length 10.9
  Top Layer w0.254: H1.6 38.43,20.23 35.69,17.48 U1.12
PIN5: length 11.7
  Top Layer w0.254: H1.7 43.01,22.64 39.07,22.64 34.31,17.88 U1.13
PIN6: length 15.5
  Top Layer w0.254: H1.9 43.01,27.72 40.34,27.72 39.32,26.7 39.32,24.92 34.81,20.41 34.81,19.1 33.99,18.28 U1.14
PIN7: length 18.5
  Top Layer w0.254: U1.15 32.6,24.68 38.31,30.39 H1.10
PIN8: length 38.2
  Top Layer w0.254: v1(33.83,26.73) 32.2,25.11 U1.16
  Bottom Layer w0.254: v1(33.83,26.73) 32.72,25.62 32.72,24.73 23.56,15.58 23.5,15.58 23.19,15.27 23.19,12.35 18.37,7.53 H2.1
PIN9: length 32.2
  Top Layer w0.254: v1(32.6,26.33) 31.8,25.53 U1.17 ; H2.3 17.35,12.61 20.91,16.16 v1(23.32,16.16)
  Bottom Layer w0.254: v1(32.6,26.33) 32.6,26.14 32.11,25.64 32.11,24.95 v1(23.32,16.16)
PIN10: length 31.6
  Top Layer w0.254: v1(31.22,25.29) 31.42,25.09 31.42,19.11 U1.18
  Bottom Layer w0.254: H2.2 19.26,10.07 22.31,13.11 22.31,15.97 31.22,24.88 v1(31.22,25.29)
PIN11: length 19.4
  Top Layer w0.254: U1.27 27.8,20.95 18.37,30.39 H2.10
PIN12: length 16.9
  Top Layer w0.254: H2.9 18.24,27.85 27,19.09 U1.28
PIN13: length 15.3
  Top Layer w0.254: U1.29 25.78,18.28 18.75,25.31 H2.8
PIN14: length 14.4
  Top Layer w0.254: U1.30 23.76,17.88 18.88,22.77 H2.7
PIN15: length 13.6
  Top Layer w0.254: U1.31 21.62,17.48 18.88,20.23 H2.6
PIN16: length 13.2
  Top Layer w0.254: U1.32 20.68,17.08 18.75,15.15 H2.4
QSPI_SCLK: length 18.3
  Top Layer w0.254: 20.68,8.67 18.62,8.67 18.24,9.05 18.24,10.13 19.07,10.95 23.33,10.95 23.69,10.59 30.45,10.59 31,11.14 U1.52
QSPI_SD0: length 13.4
  Top Layer w0.254: U2.5 22.31,9.94 22.94,9.3 30.43,9.3 31.4,10.27 U1.53
QSPI_SD1: length 7.8
  Top Layer w0.254: U1.55 32.21,12.26 32.21,10.07 29.54,7.4 U2.2
QSPI_SD2: length 29.9
  Top Layer w0.254: R14.2 35.03,6.4 33.86,5.24 29.04,5.24 28.4,4.6 23.19,4.6 22.56,5.24 22.56,7.91 23.32,8.67 30.31,8.67 31.8,10.16 U1.54
QSPI_SD3: length 20.4
  Top Layer w0.254: U1.51 30.61,12.26 30.61,11.26 30.3,10.95 23.84,10.95 23.45,11.34 18.5,11.34 17.48,10.32 17.48,8.41 18.5,7.4 U2.7
QSPI_SS: length 20.5
  Top Layer w0.254: v1(23.44,5.19) 26.8,5.19 U2.1 28.78,6.13 32.6,9.95 U1.56 ; SW1.2 21.67,4.16 v1(21.67,5.24)
  Bottom Layer w0.254: R16.2 21.03,5.88 ; 21.03,5.88 v1(21.67,5.24) ; 21.03,5.88 21.54,5.88 21.67,6 21.67,5.37 21.85,5.19 v1(23.44,5.19)
XIN: length 15.7
  Top Layer w0.254: U1.20 30.6,22.85 29.97,23.48 29.97,26.53 29.72,26.78 29.72,30.26 29.9,30.44 30.67,30.44 X1.1 31,30.31 C4.2
XOUT: length 16
  Top Layer w0.254: C5.2 25.97,30.4 28.26,28.11 28.26,27.48 29.49,26.25 29.49,23.29 30.2,22.58 U1.21
$1N1276: length 6.4
  Top Layer w0.254: v1(24.65,11.53) 25.4,11.53 25.63,11.3 28.56,11.3 29,11.74 U1.47
  Bottom Layer w0.254: v1(24.65,11.53) 25.4,11.53 R1.1
$1N1315: length 5.2
  Top Layer w0.254: U1.46 28.6,11.84 28.42,11.66 26.21,11.66 v1(25.72,12.15)
  Bottom Layer w0.254: R2.1 26.31,12.73 v1(25.72,12.15)
$1N2745: length 41.5
  Top Layer w0.254: v1(36.78,8.8) 36.78,6.38 37.93,5.24 40.72,5.24 41.99,3.97 SW2.1 ; v1(28.91,24.16) 28.2,23.46 U1.26
  Bottom Layer w0.254: v1(36.78,8.8) 36.78,10.83 35.13,12.48 35.13,15.78 34.04,16.87 34.04,25.23 34.75,25.94 34.75,26.64 33.67,27.72 32.59,27.72 29.04,24.16 v1(28.91,24.16)
$1N2987: length 3.2
  Top Layer w0.254: U1.37 25.41,15.08 24.33,13.99 R13.1
$1N3026: length 2.2
  Top Layer w0.254: U5.1 21.93,12.61 R13.2
$1N3299: length 5.3
  Top Layer w0.254: v1(30.81,13.09) 28.38,13.09 28.2,12.91 U1.45
  Bottom Layer w0.254: C3.1 32,11.91 v1(30.81,13.09)
$1N4320: length 6.7
  Bottom Layer w0.254: USB1.A5 29.65,9.03 30.18,9.56 34.76,9.56 R17.1
$1N4359: length 22
  Bottom Layer w0.254: USB1.B5 26.58,8.04 26.58,8.73 26.39,8.92 22.56,8.92 22.31,8.67 22.31,6.51 23.04,5.77 23.68,5.77 24.46,4.99 36.15,4.99 R18.2
$1N4643: length 15.7
  Top Layer w0.254: LED1.2 28.39,40.58 R19.2
$1N5849: length 14.8
  Top Layer w0.254: R20.2 30.76,40.62 36.04,45.89 36.04,47

## Copper pours and planes (outline as drawn; the poured copper is in the pictures)
GND on Top Layer: -16.94,75.98 67.77,75.98 67.77,-19.02 -16.94,-19.02
GND on Bottom Layer: -6.91,69.76 59.26,69.76 59.26,-12.03 -6.91,-12.03
